# Altium schematic sheet VOUT_0.5-2V.SchDoc
size A4; SheetNumber: 5; SheetTotal: 8
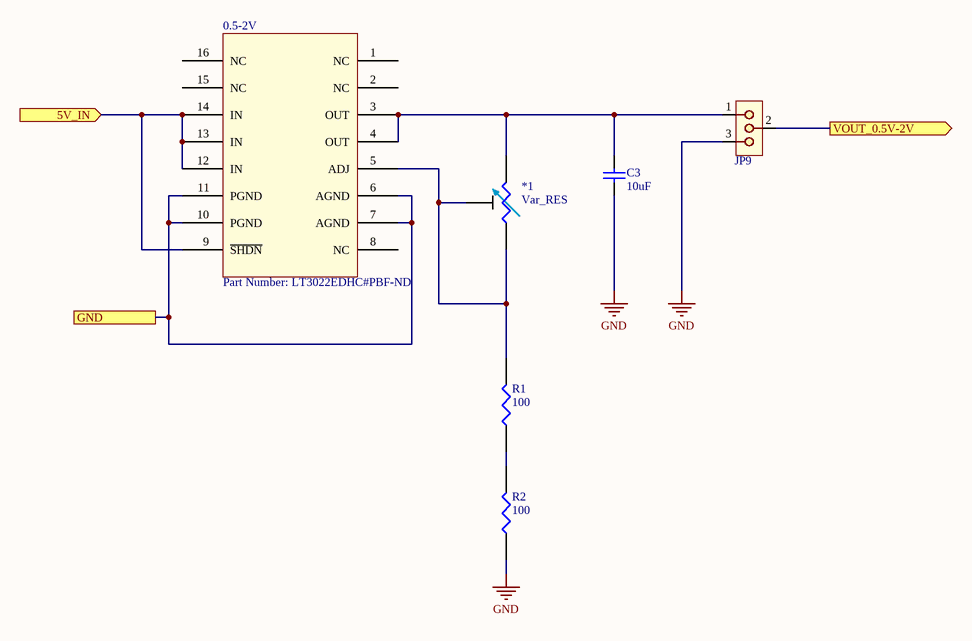
[diagram p0: VOUT_0.5-2V.SchDoc]

## Parts
0.5-2V  Part Number: LT3022EDHC#PBF-ND  [LT3022]
*1  Var_RES  [res_var_5turn]
C3  10uF  [C0805]
JP9  Jumper  [01x03_0.1in_th_straight_b_nom]  (value not drawn)
R1  100  [R0805]
R2  100  [R0805]

## Ports
5V_IN (in), GND, VOUT_0.5V-2V (out)

## Nets
GND: C3.1 JP9.3 R2.1
5V_IN: 0.5-2V.9(~{SHDN}) 0.5-2V.12(IN) 0.5-2V.13(IN) 0.5-2V.14(IN) ; port 5V_IN
GND: 0.5-2V.6(AGND) 0.5-2V.7(AGND) 0.5-2V.10(PGND) 0.5-2V.11(PGND) ; port GND  [a separate net that carries the same name]
VOUT_0.5V-2V: JP9.2 ; port VOUT_0.5V-2V
Net0.5-2V_3: 0.5-2V.3(OUT) 0.5-2V.4(OUT) *1.3 C3.2 JP9.1
Net0.5-2V_5: 0.5-2V.5(ADJ) *1.1 *1.2 R1.2
NetR1_1: R1.1 R2.2

Not connected (* = marked no-connect by the designer): 0.5-2V 1(NC) 2(NC) 8(NC) 15(NC) 16(NC)

## Library data of the parts
0.5-2V = LT3022: Linear Voltage Regulator IC Positive Adjustable 1 Output 1A 16-DFN (5x3)
C3 = Cap 10uF: Manufacturer: Taiyo Yuden; Manufacturer Part Number: UMK212SD103KD-T; Dielectric Material: Ceramic; Capacitance: 10nF; Tolerance: 10%; Voltage Rating: 50V; Supplier 1: Digi-Key; Stock 1: 14125; Pricing 1: 1=0.47, 10=0.323, 100=0.1941, 500=0.1455, 1000=0.1229 (USD); Mount: Surface Mount; Case/Package: 0805; Number of Pins: 2; Case Code (Metric): 2012; Case Code (Imperial): 0805; Min Operating Temperature: -55°C; Max Operating Temperature: 125°C; Packaging: Tape and Reel; Package Quantity: 1; Voltage Rating (DC): 50V; Termination: SMD/SMT; Length: 2mm; Height: 0.85mm; Width: 0.049inch; Thickness: 0.037inch; Depth: 1.25mm; Radiation Hardening: No; Lead Free: Lead Free; Halogen Free: Halogen Free; ComponentLink1URL: https://datasheet.ciiva.com/138/umk212sd103kd-t-ss-138661.pdf; ComponentLink1Description: https://datasheet.ciiva.com/138/umk212sd103kd-t-ss-138661.pdf; ComponentLink2URL: https://datasheet.ciiva.com/138/mlcc07-e-138662.pdf; ComponentLink2Description: https://datasheet.ciiva.com/138/mlcc07-e-138662.pdf; ComponentLink3URL: https://datasheet.ciiva.com/138/mlcc07-e-138663.pdf; ComponentLink3Description: https://datasheet.ciiva.com/138/mlcc07-e-138663.pdf; ComponentLink4URL: https://datasheet.ciiva.com/30140/303umk212sd103kd-t-30140925.pdf; ComponentLink4Description: https://datasheet.ciiva.com/30140/303umk212sd103kd-t-30140925.pdf; Supplier Part Number 1: 587-1114-1-ND
JP9 = Jumper-01x03: 01X03 generic terminal connector
R1 R2 = Res 100